# EAGLE design 18f1-k50_evkey (EAGLE 5.10)
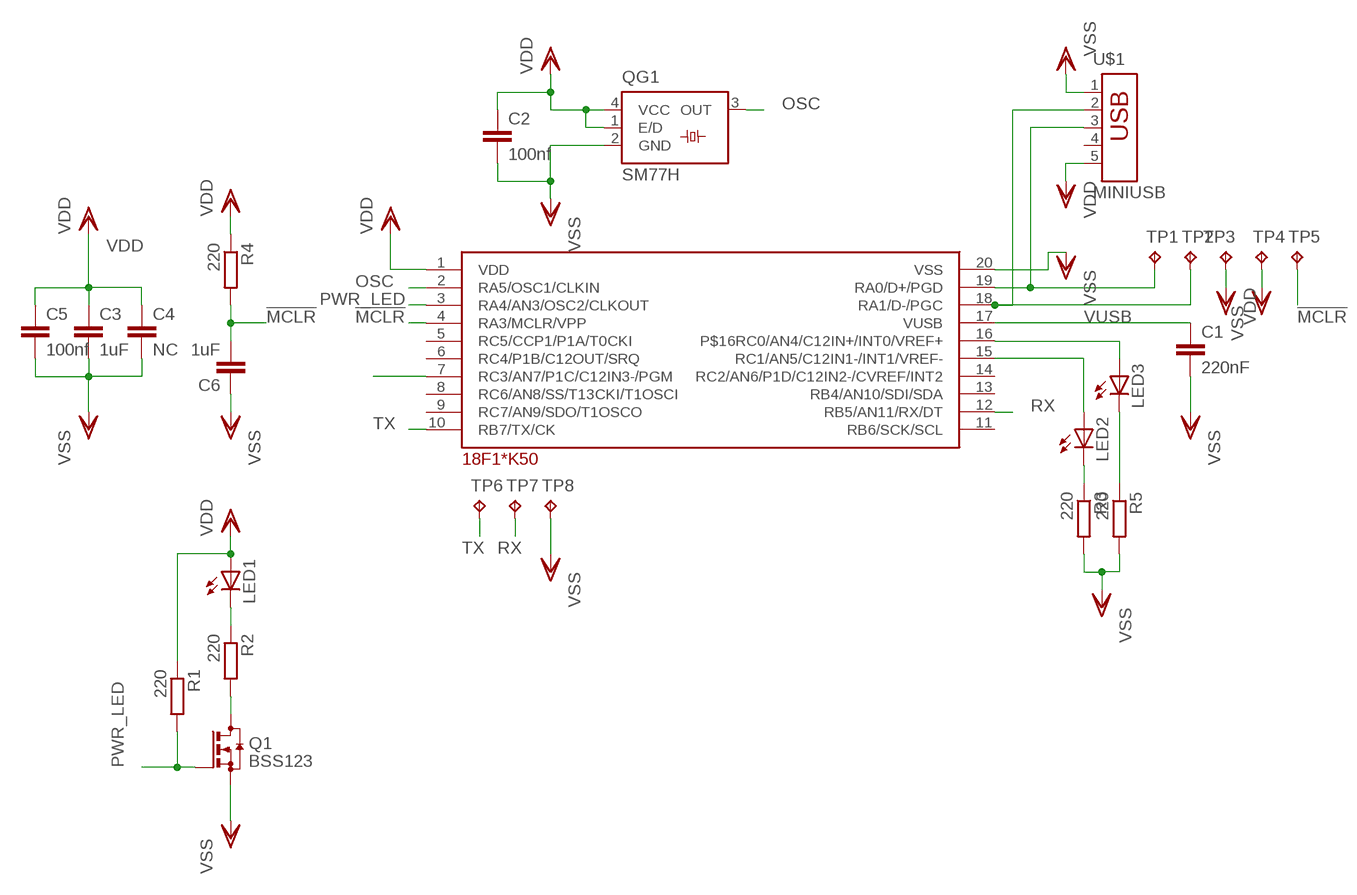
[diagram p0: schematic, sheet 1]

## Parts
C1  220nF  C-EUC0805  [C0805]
C2  100nf  C-EUC0805  [C0805]
C3  1uF  C-EUC0805  [C0805]
C4  NC  C-EUC0805  [C0805]
C5  100nf  C-EUC0805  [C0805]
C6  1uF  C-EUC0805  [C0805]
IC2  12  18F14K50-SO  [SOIC20]
LED1  LEDCHIPLED_0805  [CHIPLED_0805]
LED2  LEDCHIPLED_0805  [CHIPLED_0805]
LED3  LEDCHIPLED_0805  [CHIPLED_0805]
Q1  BSS123  [SOT23]
QG1  SM77H  [SM77H]
R1  220  R-EU_R0805  [R0805]
R2  220  R-EU_R0805  [R0805]
R3  220  R-EU_R0805  [R0805]
R4  220  R-EU_R0805  [R0805]
R5  220  R-EU_R0805  [R0805]
TP1  TPTP18R  [TP18R]
TP2  TPTP18R  [TP18R]
TP3  TPTP18R  [TP18R]
TP4  TPTP18R  [TP18R]
TP5  TPTP18R  [TP18R]
TP6  TPTP18R  [TP18R]
TP7  TPTP18R  [TP18R]
TP8  TPTP18R  [TP18R]
U$1  MINIUSB  [UX60A-MB-5SY]

## Nets
!MCLR: C6.2 IC2.4(RA3/MCLR/VPP) R4.2 TP5.TP
N$1: IC2.18(RA1/D-/PGC) TP2.TP U$1.2
N$2: IC2.7(RC3/AN7/P1C/C12IN3-/PGM)
N$3: IC2.19(RA0/D+/PGD) TP1.TP U$1.3
N$4: IC2.16(P$16RC0/AN4/C12IN+/INT0/VREF+) LED3.A
N$5: IC2.15(RC1/AN5/C12IN1-/INT1/VREF-) LED2.A
N$6: LED2.C R3.1
N$7: LED3.C R5.1
N$8: LED1.C R2.1
N$10: Q1.3(D) R2.2
OSC: IC2.2(RA5/OSC1/CLKIN) QG1.3(OUT)
PWR_LED: IC2.3(RA4/AN3/OSC2/CLKOUT) Q1.1(G) R1.2
RX: IC2.12(RB5/AN11/RX/DT) TP7.TP
TX: IC2.10(RB7/TX/CK) TP6.TP
VDD: C2.1 C3.1 C4.1 C5.1 IC2.1(VDD) LED1.A QG1.1(E/D) QG1.4(VCC) R1.1 R4.1 TP3.TP U$1.5
VSS: C1.2 C2.2 C3.2 C4.2 C5.2 C6.1 IC2.20(VSS) Q1.2(S) QG1.2(GND) R3.2 R5.2 TP4.TP TP8.TP U$1.1
VUSB: C1.1 IC2.17(VUSB)
Unconnected: IC2.5(RC5/CCP1/P1A/T0CKI) IC2.6(RC4/P1B/C12OUT/SRQ) IC2.8(RC6/AN8/SS/T13CKI/T1OSCI) IC2.9(RC7/AN9/SDO/T1OSCO) IC2.11(RB6/SCK/SCL) IC2.13(RB4/AN10/SDI/SDA) IC2.14(RC2/AN6/P1D/C12IN2-/CVREF/INT2) U$1.4

## Library data of the parts
C1 C2 C4-C6 = resistor:C-EU: CAPACITOR, European symbol
C3 = rcl:C-EU: CAPACITOR, European symbol
IC2 = rebut:18F14K50: PIC 18F14K50
LED1-LED3 = led:LED: LED OSRAM: - CHIPLED LG R971, LG N971, LY N971, LG Q971, LY Q971, LO R971, LY R971 LH N974, LH R974 LS Q976, LO Q976, LY Q976 LO Q996 - Hyper CHIPLED LW Q18S LB Q993, LB Q99A, LB R99A - SideLED LS A670, LO A670, LY A670, LG A670, LP A670 LB A673, LV A673, LT A673, LW A673 LH A674 LY A675 LS A676, LA A676, LO A676, LY A676, LW A676 LS A679, LY A679, LG A679 - Hyper Micro SIDELED® LS Y876, LA Y876, LO Y876, LY Y876 LT Y87S - SmartLED LW L88C, LW L88S LB L89C, LB L89S, LG L890 LS L89K, LO L89K, LY L89K LS L896, LA L896, LO L896, LY L896 - TOPLED LS T670, LO T670, LY T670, LG T670, LP T670 LSG T670, LSP T670, LSY T670, LOP T670, LYG T670 LG T671, LOG T671, LSG T671 LB T673, LV T673, LT T673, LW T673 LH T674 LS T676, LA T676, LO T676, LY T676, LB T676, LH T676, LSB T676, LW T676 LB T67C, LV T67C, LT T67C, LS T67K, LO T67K, LY T67K, LW E67C LS E67B, LA E67B, LO E67B, LY E67B, LB E67C, LV E67C, LT E67C LW T67C LS T679, LY T679, LG T679 LS T770, LO T770, LY T770, LG T770, LP T770 LB T773, LV T773, LT T773, LW T773 LH T774 LS E675, LA E675, LY E675, LS T675 LS T776, LA T776, LO T776, LY T776, LB T776 LHGB T686 LT T68C, LB T68C - Hyper Mini TOPLED® LB M676 - Mini TOPLED Santana® LG M470 LS M47K, LO M47K, LY M47K Source: http://www.osram.convergy.de LUXEON: - LUMILED® LXK2-PW12-R00, LXK2-PW12-S00, LXK2-PW14-U00, LXK2-PW14-V00 LXK2-PM12-R00, LXK2-PM12-S00, LXK2-PM14-U00 LXK2-PE12-Q00, LXK2-PE12-R00, LXK2-PE12-S00, LXK2-PE14-T00, LXK2-PE14-U00 LXK2-PB12-K00, LXK2-PB12-L00, LXK2-PB12-M00, LXK2-PB14-N00, LXK2-PB14-P00, LXK2-PB14-Q00 LXK2-PR12-L00, LXK2-PR12-M00, LXK2-PR14-Q00, LXK2-PR14-R00 LXK2-PD12-Q00, LXK2-PD12-R00, LXK2-PD12-S00 LXK2-PH12-R00, LXK2-PH12-S00 LXK2-PL12-P00, LXK2-PL12-Q00, LXK2-PL12-R00 Source: www.luxeon.com KINGBRIGHT: KA-3528ASYC Source: www.kingbright.com
Q1 = transistor-small-signal:BSS123: N-CHANNEL MOS FET
QG1 = crystal:SM77H: 3.3V CMOS Clock Oscillator Source: www.pletronics.com .. sm77h%203.3v.pdf
R1 = rcl:R-EU_: RESISTOR, European symbol
R2-R5 = resistor:R-EU_: RESISTOR, European symbol
TP1-TP8 = testpad:TP: Test pad
U$1 = mini-usb:MINIUSB

## Board
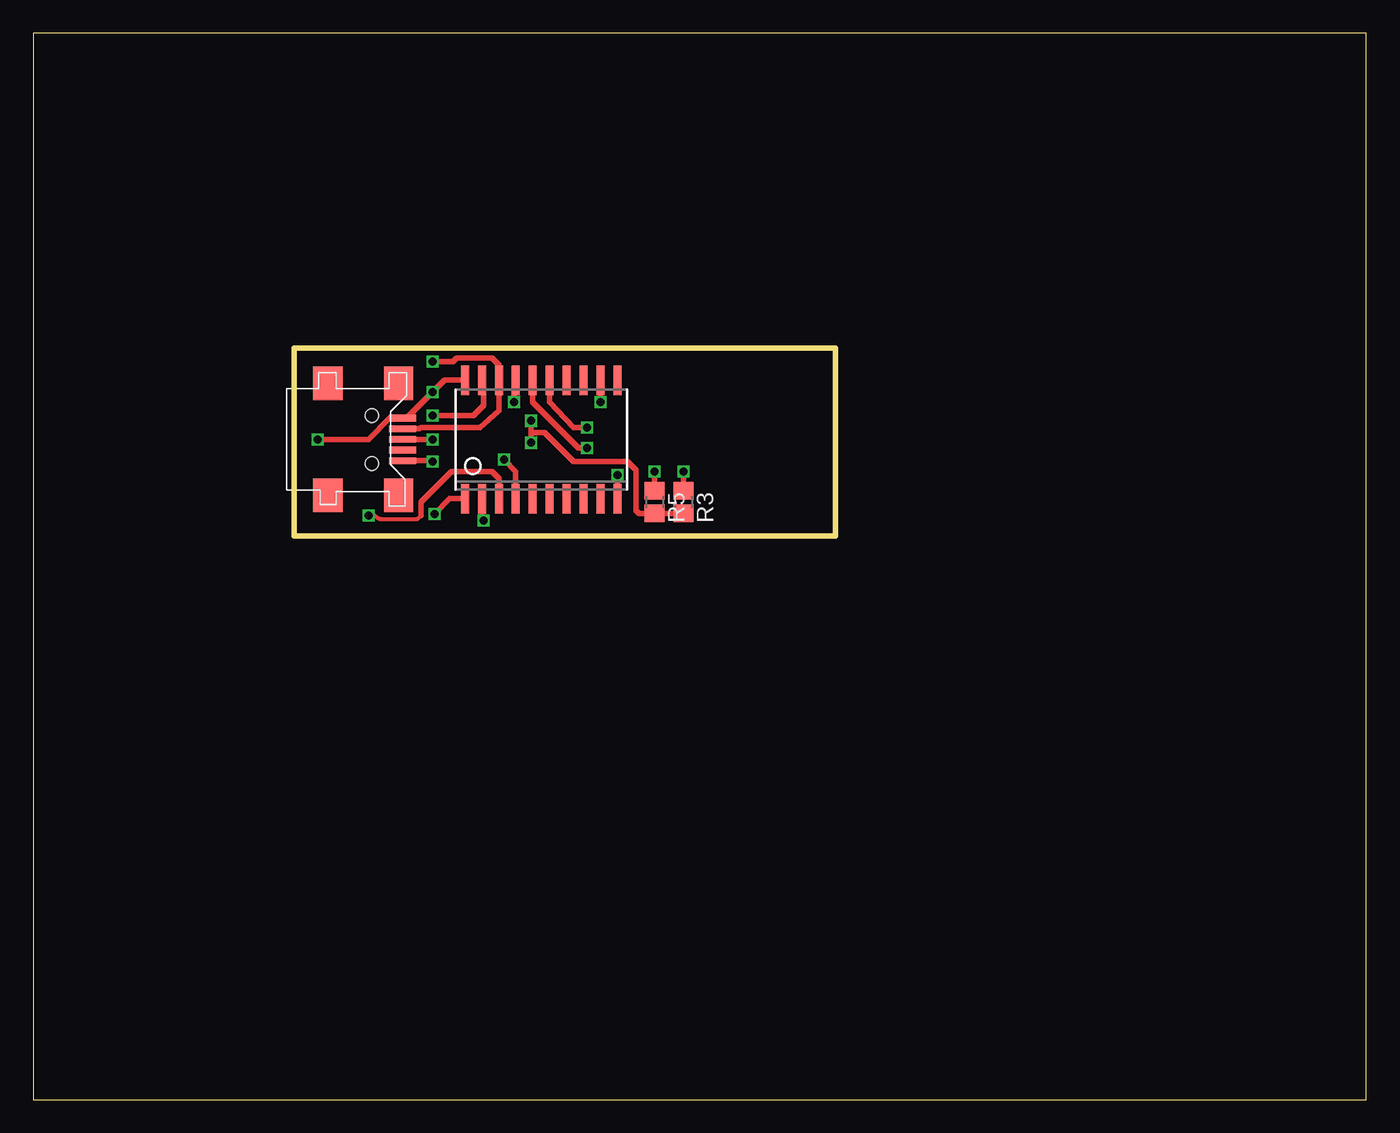
[diagram p1: board, top side]
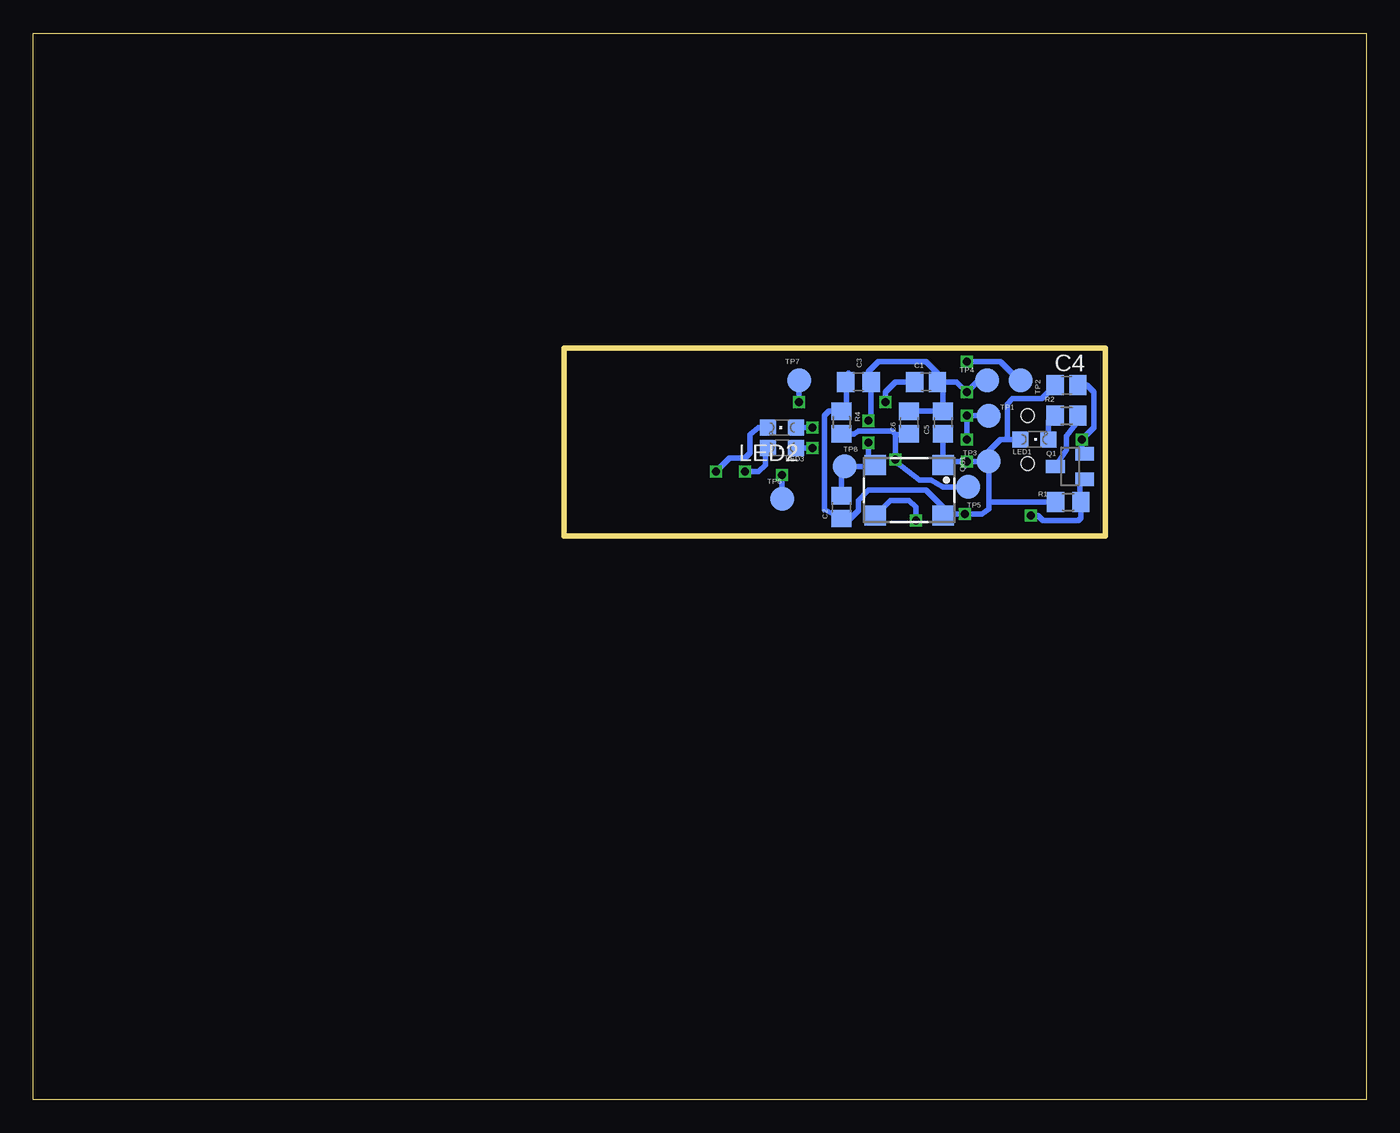
[diagram p2: board, bottom side, seen from below]

Size 100 x 80 mm. Coordinates in mm from the lower left corner, seen from the top.
Outline: 0,0 100,0 100,80 0,80 0,0
Outline: 60.2,56.39 60.2,42.3 19.56,42.3 19.56,56.39 60.2,56.39
Copper layers (1*16): Top 0.035mm / dielectric 1.5mm / Bottom 0.035mm
Design rules "Fusion_eagle_rule_v1.1 *": minimum track width 6mil, minimum drill 12mil, track to track 6mil, track to pad 6mil, pad to pad 6mil, via to via 6mil, smd to smd 0mil, copper to edge 10mil, drill to drill 10mil, minimum pad ring 10mil, minimum via ring 6mil, stop-mask expansion 2mil, vias tented up to drill 100mil, thermal gap 10mil

### Footprints (pad centres in the part's own frame; a part is rotated, then mirrored left to right if it is on the bottom)
C0805 = smd 1.3 x 1.5: 1 -0.85,0; 2 0.85,0
C0805' = smd 1.3 x 1.5: 1 -0.95,0; 2 0.95,0
SOIC20 = smd 0.6 x 2.2: 1 -5.715,-4.445; 2 -4.445,-4.445; 3 -3.175,-4.445; 4 -1.905,-4.445; 5 -0.635,-4.445; 6 0.635,-4.445; 7 1.905,-4.445; 8 3.175,-4.445; 9 4.445,-4.445; 10 5.715,-4.445; 11 5.715,4.445; 12 4.445,4.445; 13 3.175,4.445; 14 1.905,4.445; 15 0.635,4.445; 16 -0.635,4.445; 17 -1.905,4.445; 18 -3.175,4.445; 19 -4.445,4.445; 20 -5.715,4.445
CHIPLED_0805 = smd 1.2 x 1.2: A 0,-1.05; C 0,1.05
SOT23 = smd 1 x 1.4: 1 -0.95,-1.1; 2 0.95,-1.1; 3 0,1.1
SM77H = smd 1.6 x 1.5: 1 -2.55,-1.9; 2 2.55,-1.9; 3 2.55,1.9; 4 -2.55,1.9
R0805 = smd 1.3 x 1.5: 1 -0.95,0; 2 0.95,0
R0805' = smd 1.3 x 1.5: 1 -0.85,0; 2 0.85,0
TP18R = smd 1.8 x 1.8: TP 0,0
UX60A-MB-5SY = smd 0.5 x 2: 1 -1.6,2.3; 2 -0.8,2.3; 3 0,2.3; 4 0.8,2.3; 5 1.6,2.3 | smd 2.5 x 2.2: C1 -4.2,2; C2 -4.2,-3.3; C3 4.2,-3.3; C4 4.2,2 | hole 1.016: -1.8,0; 1.8,0

### Placement (x,y rotation side)
C1  33.02,53.85 0 bottom
C2  39.37,44.45 90 bottom
C3  1uF  [C0805']  38.1,53.85 0 bottom
C4  22.48,53.59 0 bottom
C5  31.75,50.8 90 bottom
C6  34.29,50.8 270 bottom
IC2  38.1,49.53 0 top
LED1  24.89,49.53 270 bottom
LED2  43.81,50.42 90 bottom
LED3  43.81,48.9 90 bottom
Q1  22.23,47.5 90 bottom
QG1  34.29,45.72 180 bottom
R1  22.35,44.83 0 bottom
R2  220  [R0805']  22.48,51.31 0 bottom
R3  220  [R0805']  48.77,44.83 270 top
R4  220  [R0805']  39.37,50.8 270 bottom
R5  220  [R0805']  46.61,44.83 270 top
TP1  28.32,51.31 270 bottom
TP2  25.91,53.98 270 bottom
TP3  28.32,47.88 270 bottom
TP4  28.45,53.98 270 bottom
TP5  29.84,45.97 270 bottom
TP6  43.81,45.09 0 bottom
TP7  42.55,53.98 0 bottom
TP8  39.12,47.5 0 bottom
U$1  25.4,49.53 270 top

### Tracks (layer width: path | path; a pad name or v marks a point on that pad's centre or on a via)
!MCLR  (via drill 0.6)
  Top 0.406: 36.2,44.7 IC2.4 36.2,47.12 v35.31,48.01
  Bottom 0.406: TP5.TP 31.75,45.97 32.64,46.48 33.53,46.48 35.31,47.88 v35.31,48.01 35.31,49.91 | R4.2 38.44,49.95 38.1,50.16 35.56,50.16 35.31,49.91 | 35.31,49.91 34.38,49.91 C6.2
N$1  (via drill 0.6)
  Top 0.406: U$1.2 28.99,50.33 29.08,50.42 33.53,50.42 34.92,51.69 IC2.18 34.92,55.12 34.42,55.63 31.75,55.63 31.5,55.37 v29.97,55.37
  Bottom 0.406: TP2.TP 26.42,54.36 27.43,55.37 v29.97,55.37
N$3  (via drill 0.6)
  Top 0.406: U$1.3 v29.97,49.53 | v29.97,51.31 33.02,51.31 33.78,52.07 33.78,53.85 IC2.19
  Bottom 0.406: v29.97,49.53 v29.97,51.31 TP1.TP
N$4  (via drill 0.6)
  Top 0.406: v41.53,48.9 40.89,48.9 37.47,52.32 IC2.16
  Bottom 0.406: v41.53,48.9 LED3.A
N$5  (via drill 0.6)
  Top 0.406: v41.53,50.42 40.51,50.42 38.73,52.32 IC2.15
  Bottom 0.406: v41.53,50.42 LED2.A
N$6  (via drill 0.6)
  Top 0.406: R3.1 v48.77,47.12
  Bottom 0.406: LED2.C 45.59,50.42 46.23,49.91 46.23,48.51 46.61,48.13 47.75,48.13 v48.77,47.12
N$7  (via drill 0.6)
  Top 0.406: R5.1 v46.61,47.12
  Bottom 0.406: v46.61,47.12 45.59,47.12 45.09,47.62 45.09,48.67 LED3.C
N$8
  Bottom 0.406: R2.1 23.84,50.92 LED1.C
N$10
  Bottom 0.406: Q1.3 22.48,48.73 22.48,49.78 21.5,51.02 R2.2
OSC  (via drill 0.6)
  Top 0.406: v33.78,43.43 33.66,43.56 IC2.2
  Bottom 0.406: QG1.3 35.7,44.96 34.29,44.96 33.78,44.45 v33.78,43.43
PWR_LED  (via drill 0.6)
  Top 0.305: 29.08,43.81 28.83,43.56 26.04,43.56 25.53,43.81
  Top 0.406: IC2.3 34.92,46.61 34.42,47.12 31.37,47.12 29.08,44.83 29.08,43.81 | v25.15,43.81 25.53,43.81
  Bottom 0.406: Q1.1 21.5,46.42 R1.2 21.4,43.62 21.59,43.43 24.26,43.43 24.64,43.81 v25.15,43.81
RX  (via drill 0.6)
  Top 0.406: v42.55,52.32 IC2.12
  Bottom 0.406: v42.55,52.32 IC2.12
TX  (via drill 0.6)
  Top 0.406: IC2.10 v43.81,46.86
  Bottom 0.406: v43.81,46.86 IC2.10
VDD  (via drill 0.6)
  Top 0.406: v29.97,47.88 30.05,47.93 U$1.5 | IC2.1 31.24,45.09 v30.1,43.94
  Bottom 0.406: QG1.1 C5.1 | 38.86,54.52 C3.1 38.95,51.65 R4.1 40.3,51.65 40.64,51.31 40.64,44.28 C2.1 38.73,43.56 38.1,44.2 38.1,44.96 37.34,45.72 33.02,45.72 31.5,44.2 31.5,44.06 QG1.4 31.61,43.94 v30.1,43.94 28.83,43.94 28.32,44.32 28.32,44.83 | QG1.1 31.74,48.01 | R1.1 28.32,44.83 | TP3.TP 28.32,47.93 | 26.92,49.53 27.43,49.53 28.32,48.64 TP3.TP | 28.32,44.83 TP3.TP | TP3.TP v29.97,47.88 31.48,47.88 QG1.1 | 26.92,49.53 LED1.A | 26.92,49.53 26.92,52.2 26.54,52.58 24.34,52.58 C4.1
VSS  (via drill 0.6)
  Top 0.406: v37.34,50.93 37.34,50.16 | 37.34,50.16 v37.34,49.28 | IC2.20 30.86,53.98 v29.97,53.09 28.02,51.13 U$1.1 26.75,51.13 25.15,49.53 v21.34,49.53 | R3.2 R5.2 45.43,43.98 45.21,44.2 45.21,47.24 44.58,47.88 40.51,47.88 38.35,50.04 37.47,50.04 37.34,50.16
  Bottom 0.406: 37.08,47.62 QG1.2 36.97,47.75 37.34,47.75 | C2.2 39.37,46.82 TP8.TP 37.59,47.5 37.34,47.75 | v37.34,49.28 37.34,47.75 | C1.2 30.73,53.85 v29.97,53.09 29.21,53.85 TP4.TP | C1.2 31.75,53.43 C5.2 C6.1 | C1.2 32.17,54.52 33.02,55.37 36.58,55.37 37.34,54.61 37.34,53.94 C3.2 37.15,51.12 v37.34,50.93 | Q1.2 21.34,48.66 v21.34,49.53 20.45,50.42 20.45,53.09 20.95,53.59 C4.2
VUSB  (via drill 0.6)
  Top 0.406: v36.07,52.32 36.07,54.1 IC2.17
  Bottom 0.254: 34.8,53.85 35.05,53.85
  Bottom 0.406: C1.1 34.8,53.85 35.31,53.85 36.07,53.09 v36.07,52.32